# EAGLE design solenoid-shield-v1 (EAGLE 7.5.0)
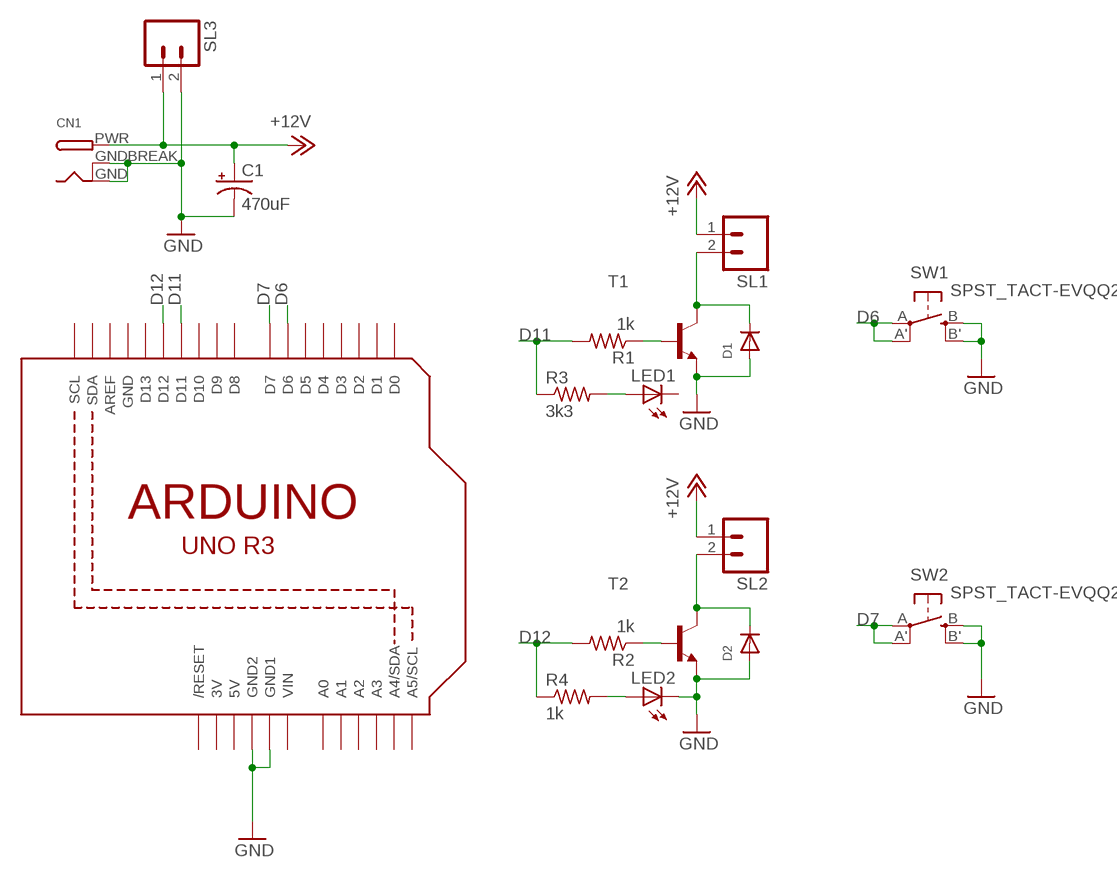
[diagram p0: schematic, sheet 1]

## Parts
C1  470uF  CPOL-USE5-13  [E5-13]
CN1  DCBARRELPTH  [DCJACK_2MM_PTH]
D1  DIODESMA  [SMADIODE]
D2  DIODESMA  [SMADIODE]
LED1  LEDSMT1206  [1206]
LED2  LEDSMT1206  [1206]
Q1  ARDUINOR3-NOIOREF-NOTEXT  [ARDUINOR3-NOTEXT-NOIOREF]
R1  1k  R-US_R0603  [R0603]
R2  1k  R-US_R0603  [R0603]
R3  3k3  R-US_R0603  [R0603]
R4  1k  R-US_R0603  [R0603]
SL1  M02  [02P]
SL2  M02  [02P]
SL3  M02  [02P]
SW1  SPST_TACT-EVQQ2  [EVQ-Q2]
SW2  SPST_TACT-EVQQ2  [EVQ-Q2]
T1  BC808-NPN-SOT23-BEC  [SOT23-BEC]
T2  BC808-NPN-SOT23-BEC  [SOT23-BEC]

## Nets
+12V: C1.+ CN1.PWR SL1.1 SL2.1 SL3.1
D6: Q1.D6 SW1.A'(P1) SW1.A(P)
D7: Q1.D7 SW2.A'(P1) SW2.A(P)
D11: Q1.D11 R1.2 R3.1
D12: Q1.D12 R2.2 R4.1
GND: C1.- CN1.GND CN1.GNDBREAK D1.A D2.A LED2.C Q1.GND1 Q1.GND2 SL3.2 SW1.B'(S1) SW1.B(S) SW2.B'(S1) SW2.B(S) T1.E T2.E
N$1: LED2.A R4.2
N$2: R1.1 T1.B
N$3: D1.C SL1.2 T1.C
N$4: LED1.A R3.2
N$7: D2.C SL2.2 T2.C
N$8: R2.1 T2.B
Unconnected: LED1.C Q1.A0 Q1.A1 Q1.A2 Q1.A3 Q1.A4(A4/SDA) Q1.A5(A5/SCL) Q1.AREF Q1.D0 Q1.D1 Q1.D2 Q1.D3 Q1.D4 Q1.D5 Q1.D8 Q1.D9 Q1.D10 Q1.D13 Q1.RESET(/RESET) Q1.SCL Q1.SDA

## Power pins joined to a net without a drawn wire
3V: Q1.3V
5V: Q1.5V
GND: Q1.GND
VIN: Q1.VIN

## Library data of the parts
C1 = adafruit:CPOL-US: POLARIZED CAPACITOR, American symbol
CN1 = adafruit:DCBARREL: 2.0mm DC Barrel Jack DCJACK_2MM_PTH - Through Hole Jack (4UConnector: 05537)
D1 D2 = adafruit:DIODE: Diode SMADIODE - SMA Surface Mount Package 20V 1A Schottky Diode Digikey: 641-1014-6-ND DO-1N4148 - Through Hole Small Current Diode SOD-123 20V 1 A (.5mV Vf) Schottky Diode - Digikey: MBRX120TPMSCT-ND SOD-323 10V 570mA (.38mV Vf, 3ns) Schottky Diode - Digikey: ZLLS410CT-ND SOD-523 30V 30mA Schottky Diode (RB751S-40TE61) - Digikey: RB751S-40TE61CT-ND SOT23-R/W - SOT23 Package (R = Solder Paste/Reflow Ovens, W = Hand-Soldering) BAT54Film 40V 300mA - Digikey: 497-7162-1-ND
LED1 LED2 = adafruit:LED: LED OSRAM: - CHIPLED LG R971, LG N971, LY N971, LG Q971, LY Q971, LO R971, LY R971 LH N974, LH R974 LS Q976, LO Q976, LY Q976 LO Q996 - Hyper CHIPLED LW Q18S LB Q993, LB Q99A, LB R99A - SideLED LS A670, LO A670, LY A670, LG A670, LP A670 LB A673, LV A673, LT A673, LW A673 LH A674 LY A675 LS A676, LA A676, LO A676, LY A676, LW A676 LS A679, LY A679, LG A679 - Hyper Micro SIDELED® LS Y876, LA Y876, LO Y876, LY Y876 LT Y87S - SmartLED LW L88C, LW L88S LB L89C, LB L89S, LG L890 LS L89K, LO L89K, LY L89K LS L896, LA L896, LO L896, LY L896 - TOPLED LS T670, LO T670, LY T670, LG T670, LP T670 LSG T670, LSP T670, LSY T670, LOP T670, LYG T670 LG T671, LOG T671, LSG T671 LB T673, LV T673, LT T673, LW T673 LH T674 LS T676, LA T676, LO T676, LY T676, LB T676, LH T676, LSB T676, LW T676 LB T67C, LV T67C, LT T67C, LS T67K, LO T67K, LY T67K, LW E67C LS E67B, LA E67B, LO E67B, LY E67B, LB E67C, LV E67C, LT E67C LW T67C LS T679, LY T679, LG T679 LS T770, LO T770, LY T770, LG T770, LP T770 LB T773, LV T773, LT T773, LW T773 LH T774 LS E675, LA E675, LY E675, LS T675 LS T776, LA T776, LO T776, LY T776, LB T776 LHGB T686 LT T68C, LB T68C - Hyper Mini TOPLED® LB M676 - Mini TOPLED Santana® LG M470 LS M47K, LO M47K, LY M47K Source: http://www.osram.convergy.de/
Q1 = adafruit:ARDUINOR3-NOIOREF
R1-R4 = adafruit:R-US_: RESISTOR, American symbol
SL1-SL3 = con-amp-quick:M02: AMP QUICK CONNECTOR; OC_FARNELL: unknown; OC_NEWARK: unknown
SW1 SW2 = adafruit:SPST_TACT: SMT 6mm switch, EVQQ2 series http://www.ladyada.net/library/eagle
T1 T2 = transistor:*-NPN-: NPN Transistror BF959 corrected 2008.03.06

## Board
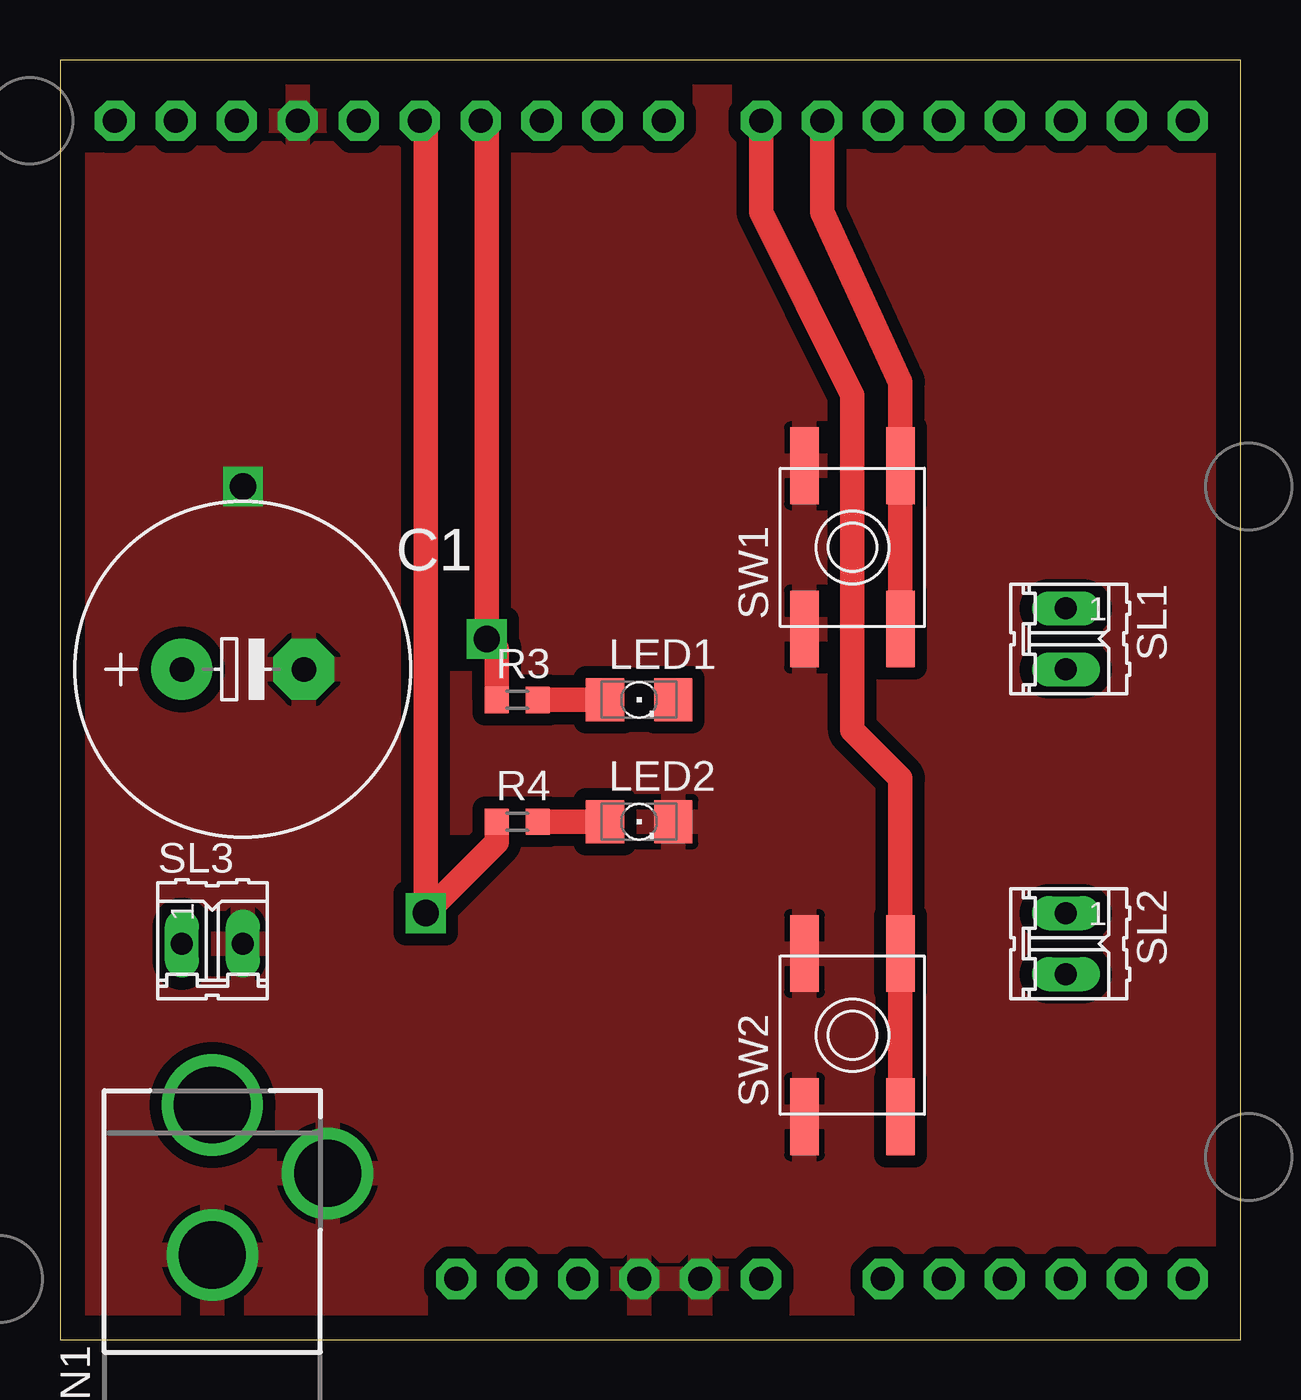
[diagram p1: board, top side]
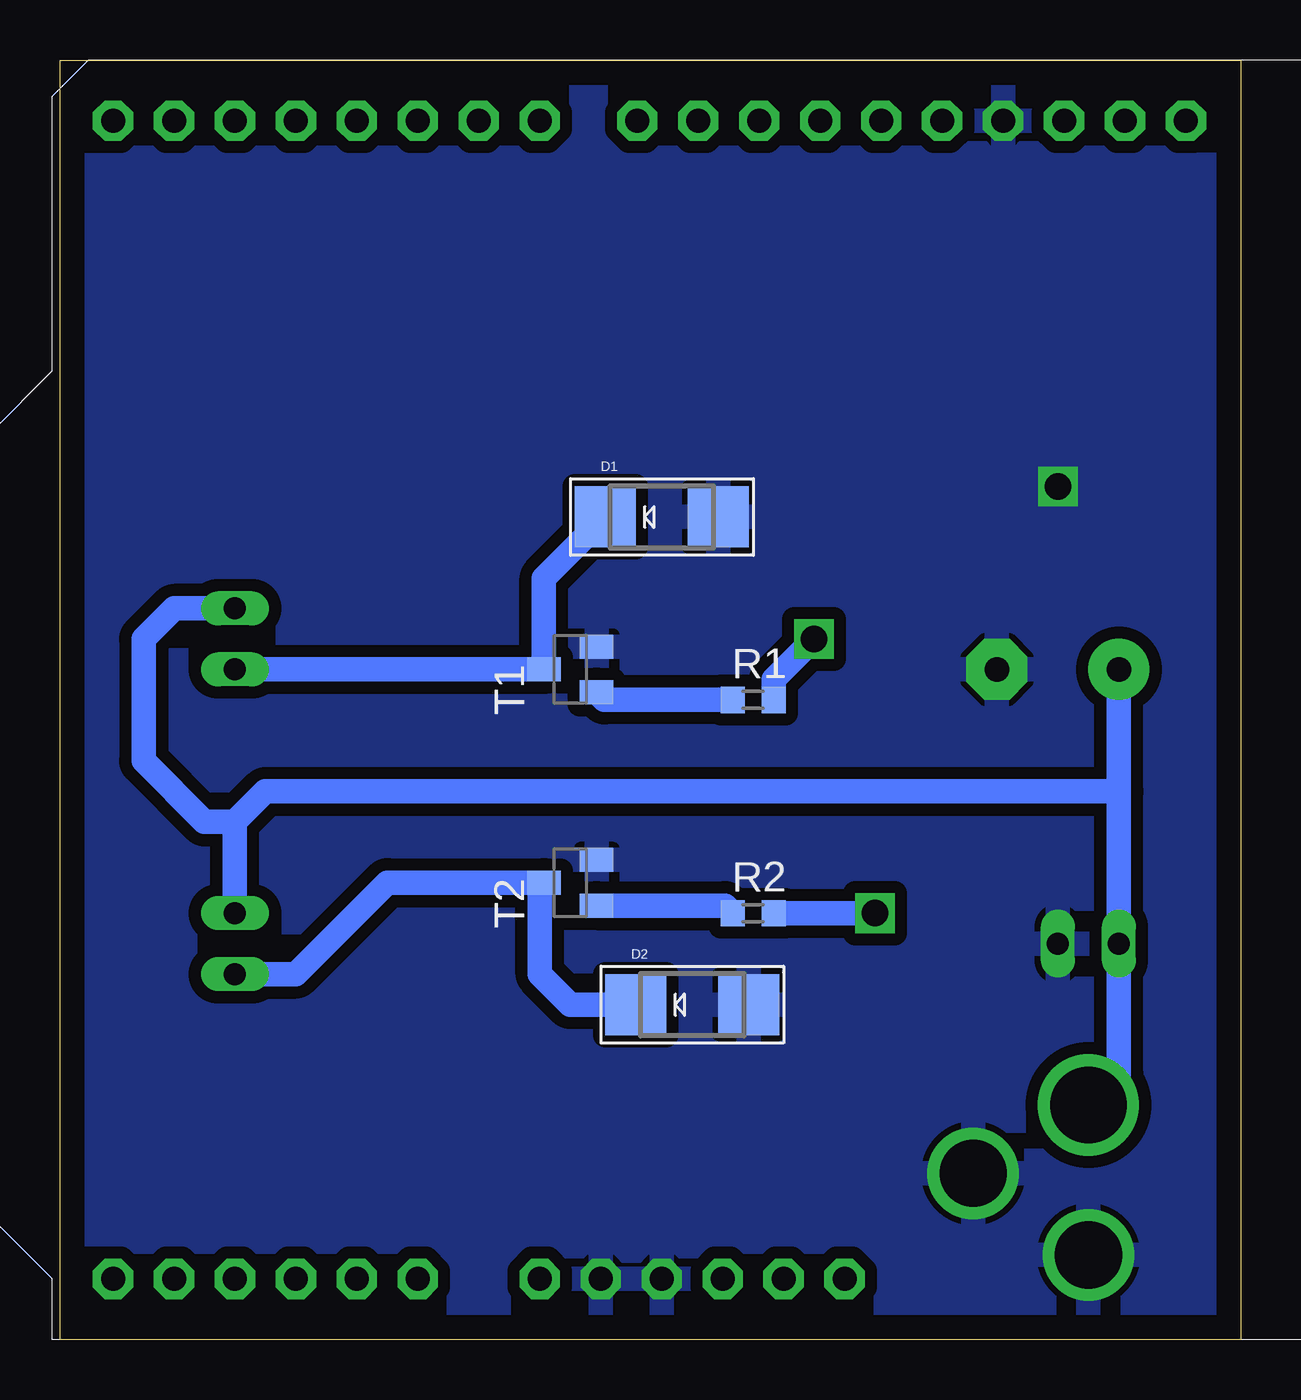
[diagram p2: board, bottom side, seen from below]

Size 49.2 x 53.33 mm. Coordinates in mm from the lower left corner, seen from the top.
Outline: 0,0 49.2,0 49.2,53.33 0,53.33 0,0
Copper layers (1*16): Top 0.035mm / dielectric 1.5mm / Bottom 0.035mm
Design rules "default *": minimum track width 10mil, minimum drill 24mil, track to track 20mil, track to pad 20mil, pad to pad 20mil, via to via 20mil, smd to smd 20mil, copper to edge 40mil, drill to drill 8mil, minimum pad ring 10mil, minimum via ring 8mil, stop-mask expansion 4mil, vias tented up to drill 0mil, thermal gap 10mil

### Footprints (pad centres in the part's own frame; a part is rotated, then mirrored left to right if it is on the bottom)
E5-13 = drill 1.016 pad 2.54: + -2.54,0 | drill 1.016 pad 2.54 octagon: - 2.54,0
DCJACK_2MM_PTH = drill 2.8: GND 0,7.35; GNDBREAK 4.8,10.75 | drill 3.2: PWR 0,13.6
SMADIODE = smd 2.54 x 2.54: A 2.349,0; C -2.349,0
1206 = smd 1.6 x 1.803: A -1.422,0; C 1.422,0
ARDUINOR3-NOTEXT-NOIOREF = drill 1 pad 1.676 octagon: 3V 35.56,2.54; 5V 38.1,2.54; A0 50.8,2.54; A1 53.34,2.54; A2 55.88,2.54; A3 58.42,2.54; A4 60.96,2.54; A5 63.5,2.54; AREF 23.876,50.8; D0 63.5,50.8; D1 60.96,50.8; D2 58.42,50.8; D3 55.88,50.8; D4 53.34,50.8; D5 50.8,50.8; D6 48.26,50.8; D7 45.72,50.8; D8 41.656,50.8; D9 39.116,50.8; D10 36.576,50.8; D11 34.036,50.8; D12 31.496,50.8; D13 28.956,50.8; GND 26.416,50.8; GND1 43.18,2.54; GND2 40.64,2.54; RESET 33.02,2.54; SCL 18.796,50.8; SDA 21.336,50.8; VIN 45.72,2.54
R0603 = smd 1 x 1.1: 1 -0.85,0; 2 0.85,0
02P = drill 0.914 long: 1 -1.27,0; 2 1.27,0
EVQ-Q2 = smd 3.2 x 1.2: A -3.4,-2; A' 3.4,-2; B -3.4,2; B' 3.4,2
SOT23-BEC = smd 1 x 1.4: B -0.95,-1.1; C 0,1.1; E 0.95,-1.1

### Placement (x,y rotation side)
C1  7.62,27.94 0 top
CN1  6.35,-3.81 0 top
D1  24.13,34.29 0 bottom
D2  22.86,13.97 0 bottom
LED1  24.13,26.67 0 top
LED2  24.13,21.59 0 top
Q1  -16.51,0 0 top
R1  20.32,26.67 0 bottom
R2  20.32,17.78 0 bottom
R3  19.05,26.67 0 top
R4  19.05,21.59 0 top
SL1  41.91,29.21 270 top
SL2  41.91,16.51 270 top
SL3  6.35,16.51 0 top
SW1  33.02,33.02 90 top
SW2  33.02,12.7 90 top
T1  27.94,27.94 90 bottom
T2  27.94,19.05 90 bottom

### Tracks (layer width: path | path; a pad name or v marks a point on that pad's centre or on a via)
+12V
  Bottom 1.016: CN1.PWR 5.08,11.06 SL3.1 5.08,22.86 | SL2.1 41.91,21.59 | 41.91,21.59 40.64,22.86 5.08,22.86 | SL1.1 44.45,30.48 45.72,29.21 45.72,24.13 43.18,21.59 41.91,21.59 | 5.08,22.86 C1.+
D6
  Top 1.016: Q1.D6 31.75,46.99 35.02,39.91 SW1.A' SW1.A
D7
  Top 1.016: Q1.D7 29.21,46.99 33.02,39.37 33.02,25.4 35.02,23.4 SW2.A' SW2.A
D11  (via drill 1.1)
  Top 1.016: Q1.D11 17.78,50.55 v17.78,29.21 18.2,28.79 R3.1
  Bottom 1.016: R1.2 19.47,27.52 v17.78,29.21
D12  (via drill 1.1)
  Top 1.016: Q1.D12 15.24,50.55 v15.24,17.78 18.2,20.74 R4.1
  Bottom 1.016: R2.2 v15.24,17.78
GND  (via drill 1.1)
  other vias: 7.62,35.56
  pour Top: 0,53.34 49.53,53.34 49.53,0 0,0
  pour Bottom: 0,53.34 49.53,53.34 49.53,0 0,0
N$1
  Top 1.016: LED2.A R4.2
N$2
  Bottom 1.016: R1.1 26.52,26.67 T1.B
N$3
  Bottom 1.016: SL1.2 T1.C 29.04,31.73 D1.C
N$4
  Top 1.016: LED1.A R3.2
N$7
  Bottom 1.016: SL2.2 39.37,15.24 35.56,19.05 T2.C 29.21,18.88 29.21,15.24 27.94,13.97 D2.C
N$8
  Bottom 1.016: T2.B 21.49,18.1 R2.1